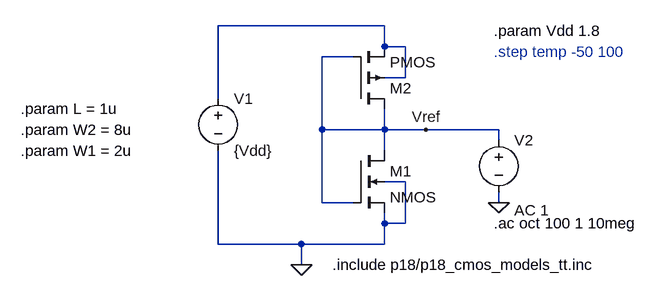
[diagram p0: schematic MOS_ONLY_V1.asc]
MOS_ONLY_V1.asc, the LTspice schematic file:
Version 4
SHEET 1 884 680
WIRE 240 -32 -16 -32
WIRE 240 0 240 -32
WIRE 272 0 240 0
WIRE 192 16 144 16
WIRE 272 48 272 0
WIRE 272 48 240 48
WIRE -16 80 -16 -32
WIRE 144 128 144 16
WIRE 240 128 240 96
WIRE 240 128 144 128
WIRE 304 128 240 128
WIRE 416 128 304 128
WIRE 416 144 416 128
WIRE 240 160 240 128
WIRE 272 208 240 208
WIRE 144 240 144 128
WIRE 192 240 144 240
WIRE 416 240 416 224
WIRE 240 272 240 256
WIRE 272 272 272 208
WIRE 272 272 240 272
WIRE -16 304 -16 160
WIRE 112 304 -16 304
WIRE 240 304 240 272
WIRE 240 304 112 304
WIRE 112 336 112 304
FLAG 304 128 Vref
FLAG 112 336 0
FLAG 416 240 0
SYMBOL nmos4 192 160 R0
SYMATTR InstName M1
SYMATTR Value2 l={L} w={W1}
SYMBOL pmos4 192 96 M180
SYMATTR InstName M2
SYMATTR Value2 l={L} w={W2}
SYMBOL voltage -16 64 R0
WINDOW 123 24 124 Left 2
WINDOW 39 0 0 Left 2
SYMATTR InstName V1
SYMATTR Value {Vdd}
SYMBOL voltage 416 128 R0
WINDOW 3 24 152 Left 2
WINDOW 123 24 124 Left 2
WINDOW 39 0 0 Left 2
SYMATTR InstName V2
SYMATTR Value ""
SYMATTR Value2 AC 1
TEXT 408 -24 Left 2 !.param Vdd 1.8
TEXT 408 8 Left 2 ;.step temp -50 100
TEXT 408 272 Left 2 !.ac oct 100 1 10meg
TEXT 160 336 Left 2 !.include p18/p18_cmos_models_tt.inc
TEXT -320 96 Left 2 !.param L = 1u
TEXT -320 128 Left 2 !.param W2 = 8u
TEXT -320 160 Left 2 !.param W1 = 2u

The netlist it stands for:
* MOS_ONLY_V1.asc
M1 Vref Vref 0 0 NMOS l={L} w={W1}
M2 Vref Vref N001 N001 PMOS l={L} w={W2}
V1 N001 0 {Vdd}
V2 Vref 0 AC 1
.model NMOS NMOS
.model PMOS PMOS
.lib standard.mos
.param Vdd 1.8
* .step temp -50 100
.ac oct 100 1 10meg
.include p18/p18_cmos_models_tt.inc
.param L = 1u
.param W2 = 8u
.param W1 = 2u
.backanno
.end